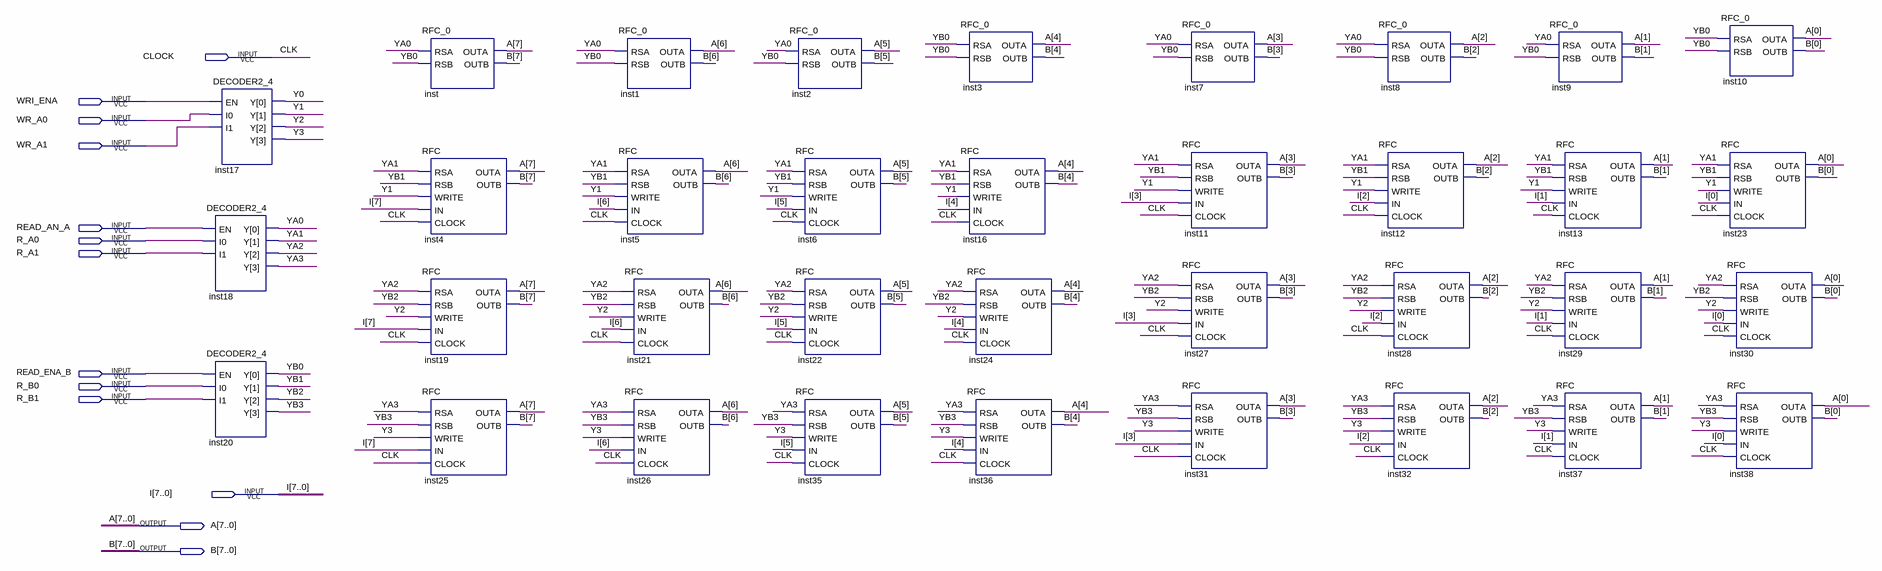
[diagram p0: schematic sheet]
// Quartus schematic REGISTER_FILE.bdf as structural Verilog: 35 symbols, 13 pins
module REGISTER_FILE (
  input  CLOCK,
  input  WRI_ENA,
  input  WR_A0,
  input  WR_A1,
  input  READ_AN_A,
  input  R_A0,
  input  R_A1,
  input  READ_ENA_B,
  input  R_B0,
  input  R_B1,
  input  [7:0] I,
  output [7:0] A,
  output [7:0] B
);

  wire Y0, Y1, Y2, Y3, YA0, YA1, YA2, YA3, YB0, YB1, YB2, YB3;

  DECODER2_4 inst17 (.EN(WRI_ENA), .I0(WR_A0), .I1(WR_A1), .Y({Y3, Y2, Y1, Y0}));
  DECODER2_4 inst18 (.EN(READ_AN_A), .I0(R_A0), .I1(R_A1), .Y({YA3, YA2, YA1, YA0}));
  DECODER2_4 inst20 (.EN(READ_ENA_B), .I0(R_B0), .I1(R_B1), .Y({YB3, YB2, YB1, YB0}));
  RFC_0 inst (.RSA(YA0), .RSB(YB0), .OUTA(A[7]), .OUTB(B[7]));
  RFC inst4 (.RSA(YA1), .RSB(YB1), .WRITE(Y1), .IN(I[7]), .CLOCK(CLOCK), .OUTA(A[7]), .OUTB(B[7]));
  RFC inst19 (.RSA(YA2), .RSB(YB2), .WRITE(Y2), .IN(I[7]), .CLOCK(CLOCK), .OUTA(A[7]), .OUTB(B[7]));
  RFC inst25 (.RSA(YA3), .RSB(YB3), .WRITE(Y3), .IN(I[7]), .CLOCK(CLOCK), .OUTA(A[7]), .OUTB(B[7]));
  RFC_0 inst1 (.RSA(YA0), .RSB(YB0), .OUTA(A[6]), .OUTB(B[6]));
  RFC inst5 (.RSA(YA1), .RSB(YB1), .WRITE(Y1), .IN(I[6]), .CLOCK(CLOCK), .OUTA(A[6]), .OUTB(B[6]));
  RFC inst21 (.RSA(YA2), .RSB(YB2), .WRITE(Y2), .IN(I[6]), .CLOCK(CLOCK), .OUTA(A[6]), .OUTB(B[6]));
  RFC inst26 (.RSA(YA3), .RSB(YB3), .WRITE(Y3), .IN(I[6]), .CLOCK(CLOCK), .OUTA(A[6]), .OUTB(B[6]));
  RFC_0 inst2 (.RSA(YA0), .RSB(YB0), .OUTA(A[5]), .OUTB(B[5]));
  RFC inst6 (.RSA(YA1), .RSB(YB1), .WRITE(Y1), .IN(I[5]), .CLOCK(CLOCK), .OUTA(A[5]), .OUTB(B[5]));
  RFC inst22 (.RSA(YA2), .RSB(YB2), .WRITE(Y2), .IN(I[5]), .CLOCK(CLOCK), .OUTA(A[5]), .OUTB(B[5]));
  RFC inst35 (.RSA(YA3), .RSB(YB3), .WRITE(Y3), .IN(I[5]), .CLOCK(CLOCK), .OUTA(A[5]), .OUTB(B[5]));
  RFC_0 inst3 (.RSA(YB0), .RSB(YB0), .OUTA(A[4]), .OUTB(B[4]));
  RFC inst16 (.RSA(YA1), .RSB(YB1), .WRITE(Y1), .IN(I[4]), .CLOCK(CLOCK), .OUTA(A[4]), .OUTB(B[4]));
  RFC inst24 (.RSA(YA2), .RSB(YB2), .WRITE(Y2), .IN(I[4]), .CLOCK(CLOCK), .OUTA(A[4]), .OUTB(B[4]));
  RFC inst36 (.RSA(YA3), .RSB(YB3), .WRITE(Y3), .IN(I[4]), .CLOCK(CLOCK), .OUTA(A[4]), .OUTB(B[4]));
  RFC_0 inst7 (.RSA(YA0), .RSB(YB0), .OUTA(A[3]), .OUTB(B[3]));
  RFC inst11 (.RSA(YA1), .RSB(YB1), .WRITE(Y1), .IN(I[3]), .CLOCK(CLOCK), .OUTA(A[3]), .OUTB(B[3]));
  RFC inst27 (.RSA(YA2), .RSB(YB2), .WRITE(Y2), .IN(I[3]), .CLOCK(CLOCK), .OUTA(A[3]), .OUTB(B[3]));
  RFC inst31 (.RSA(YA3), .RSB(YB3), .WRITE(Y3), .IN(I[3]), .CLOCK(CLOCK), .OUTA(A[3]), .OUTB(B[3]));
  RFC_0 inst8 (.RSA(YA0), .RSB(YB0), .OUTA(A[2]), .OUTB(B[2]));
  RFC inst12 (.RSA(YA1), .RSB(YB1), .WRITE(Y1), .IN(I[2]), .CLOCK(CLOCK), .OUTA(A[2]), .OUTB(B[2]));
  RFC inst28 (.RSA(YA2), .RSB(YB2), .WRITE(Y2), .IN(I[2]), .CLOCK(CLOCK), .OUTA(A[2]), .OUTB(B[2]));
  RFC inst32 (.RSA(YA3), .RSB(YB3), .WRITE(Y3), .IN(I[2]), .CLOCK(CLOCK), .OUTA(A[2]), .OUTB(B[2]));
  RFC_0 inst9 (.RSA(YA0), .RSB(YB0), .OUTA(A[1]), .OUTB(B[1]));
  RFC inst13 (.RSA(YA1), .RSB(YB1), .WRITE(Y1), .IN(I[1]), .CLOCK(CLOCK), .OUTA(A[1]), .OUTB(B[1]));
  RFC inst29 (.RSA(YA2), .RSB(YB2), .WRITE(Y2), .IN(I[1]), .CLOCK(CLOCK), .OUTA(A[1]), .OUTB(B[1]));
  RFC inst37 (.RSA(YA3), .RSB(YB3), .WRITE(Y3), .IN(I[1]), .CLOCK(CLOCK), .OUTA(A[1]), .OUTB(B[1]));
  RFC_0 inst10 (.RSA(YB0), .RSB(YB0), .OUTA(A[0]), .OUTB(B[0]));
  RFC inst23 (.RSA(YA1), .RSB(YB1), .WRITE(Y1), .IN(I[0]), .CLOCK(CLOCK), .OUTA(A[0]), .OUTB(B[0]));
  RFC inst30 (.RSA(YA2), .RSB(YB2), .WRITE(Y2), .IN(I[0]), .CLOCK(CLOCK), .OUTA(A[0]), .OUTB(B[0]));
  RFC inst38 (.RSA(YA3), .RSB(YB3), .WRITE(Y3), .IN(I[0]), .CLOCK(CLOCK), .OUTA(A[0]), .OUTB(B[0]));

  // Other names for the same wires on the sheet: CLK = CLOCK
endmodule
